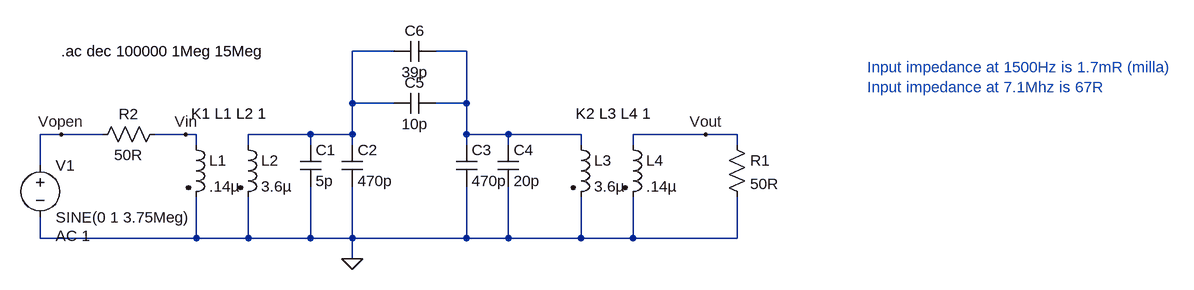
[diagram p0: schematic 80m QRPLabs BPF.asc]
80m QRPLabs BPF.asc, the LTspice schematic file:
Version 4
SHEET 1 1652 680
WIRE 368 16 304 16
WIRE 480 16 432 16
WIRE 304 96 304 16
WIRE 368 96 304 96
WIRE 480 96 480 16
WIRE 480 96 432 96
WIRE -144 144 -176 144
WIRE -80 144 -144 144
WIRE 48 144 0 144
WIRE 64 144 48 144
WIRE 240 144 144 144
WIRE 304 144 304 96
WIRE 304 144 240 144
WIRE 480 144 480 96
WIRE 544 144 480 144
WIRE 656 144 544 144
WIRE 848 144 736 144
WIRE 896 144 848 144
WIRE 64 160 64 144
WIRE 144 160 144 144
WIRE 240 160 240 144
WIRE 304 160 304 144
WIRE 480 160 480 144
WIRE 544 160 544 144
WIRE 656 160 656 144
WIRE 736 160 736 144
WIRE 896 160 896 144
WIRE -176 192 -176 144
WIRE -176 304 -176 272
WIRE 64 304 64 240
WIRE 64 304 -176 304
WIRE 144 304 144 240
WIRE 144 304 64 304
WIRE 240 304 240 224
WIRE 240 304 144 304
WIRE 304 304 304 224
WIRE 304 304 240 304
WIRE 480 304 480 224
WIRE 480 304 304 304
WIRE 544 304 544 224
WIRE 544 304 480 304
WIRE 656 304 656 240
WIRE 656 304 544 304
WIRE 736 304 736 240
WIRE 736 304 656 304
WIRE 896 304 896 240
WIRE 896 304 736 304
WIRE 304 336 304 304
FLAG 304 336 0
FLAG 48 144 Vin
FLAG -144 144 Vopen
FLAG 848 144 Vout
SYMBOL voltage -176 176 R0
WINDOW 123 24 124 Left 2
WINDOW 39 0 0 Left 2
SYMATTR Value2 AC 1
SYMATTR InstName V1
SYMATTR Value SINE(0 1 3.75Meg)
SYMBOL cap 224 160 R0
SYMATTR InstName C1
SYMATTR Value 5p
SYMBOL cap 288 160 R0
SYMATTR InstName C2
SYMATTR Value 470p
SYMBOL cap 464 160 R0
SYMATTR InstName C3
SYMATTR Value 470p
SYMBOL cap 528 160 R0
SYMATTR InstName C4
SYMATTR Value 20p
SYMBOL cap 432 80 R90
WINDOW 0 0 32 VBottom 2
WINDOW 3 32 32 VTop 2
SYMATTR InstName C5
SYMATTR Value 10p
SYMBOL cap 432 0 R90
WINDOW 0 0 32 VBottom 2
WINDOW 3 32 32 VTop 2
SYMATTR InstName C6
SYMATTR Value 39p
SYMBOL ind2 48 144 R0
SYMATTR InstName L1
SYMATTR Value .14µ
SYMATTR Type ind
SYMBOL ind2 128 144 R0
SYMATTR InstName L2
SYMATTR Value 3.6µ
SYMATTR Type ind
SYMBOL ind2 640 144 R0
SYMATTR InstName L3
SYMATTR Value 3.6µ
SYMATTR Type ind
SYMBOL ind2 720 144 R0
SYMATTR InstName L4
SYMATTR Value .14µ
SYMATTR Type ind
SYMBOL res 880 144 R0
SYMATTR InstName R1
SYMATTR Value 50R
SYMBOL res 16 128 R90
WINDOW 0 0 56 VBottom 2
WINDOW 3 32 56 VTop 2
SYMATTR InstName R2
SYMATTR Value 50R
TEXT 56 112 Left 2 !K1 L1 L2 1
TEXT 648 112 Left 2 !K2 L3 L4 1
TEXT -144 16 Left 2 !.ac dec 100000 1Meg 15Meg
TEXT 1096 40 Left 2 ;Input impedance at 1500Hz is 1.7mR (milla)\nInput impedance at 7.1Mhz is 67R

The netlist it stands for:
* 80m QRPLabs BPF.asc
V1 Vopen 0 SINE(0 1 3.75Meg) AC 1
C1 N001 0 5p
C2 N001 0 470p
C3 N002 0 470p
C4 N002 0 20p
C5 N002 N001 10p
C6 N002 N001 39p
L1 Vin 0 .14µ
L2 N001 0 3.6µ
L3 N002 0 3.6µ
L4 Vout 0 .14µ
R1 Vout 0 50R
R2 Vin Vopen 50R
K1 L1 L2 1
K2 L3 L4 1
.ac dec 100000 1Meg 15Meg
* Input impedance at 1500Hz is 1.7mR (milla)
* Input impedance at 7.1Mhz is 67R
.backanno
.end